# Altium schematic sheet CONNECTED-MODULE.SchDoc
size A; SheetNumber: 1; SheetTotal: 3
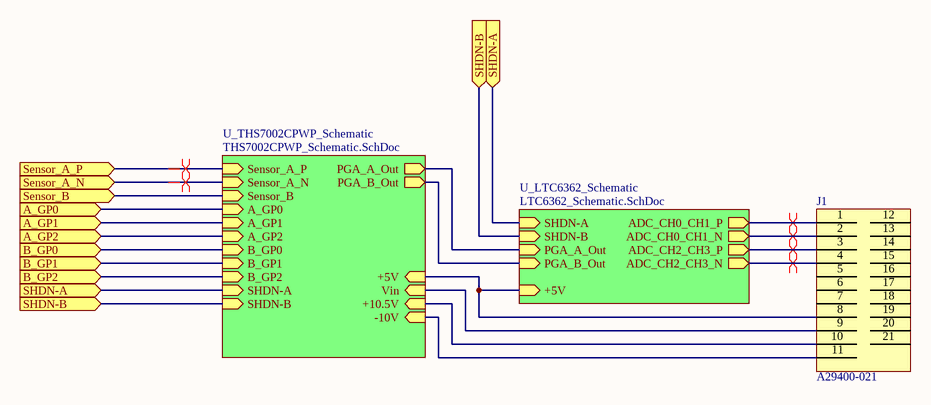
[diagram p0: CONNECTED-MODULE.SchDoc]

## Parts
J1  A29400-021

## Sub-sheets
U_LTC6362_Schematic = LTC6362_Schematic.SchDoc: SHDN-A (in), SHDN-B (in), ADC_CH2_CH3_P (out), ADC_CH2_CH3_N (out), ADC_CH0_CH1_P (out), ADC_CH0_CH1_N (out), PGA_A_Out (in), PGA_B_Out (in), +5V (in)
U_THS7002CPWP_Schematic = THS7002CPWP_Schematic.SchDoc: Sensor_A_P (in), Sensor_A_N (in), Sensor_B (in), A_GP0 (in), B_GP0 (in), A_GP1 (in), A_GP2 (in), B_GP1 (in), B_GP2 (in), SHDN-A (in), SHDN-B (in), PGA_A_Out (out), PGA_B_Out (out), +10.5V (in), -10V (in), +5V (in), Vin (in)

## Ports
A_GP0 (in), A_GP1 (in), A_GP2 (in), B_GP0 (in), B_GP1 (in), B_GP2 (in), Sensor_A_N (in), Sensor_A_P (in), Sensor_B (in), SHDN-A (in), SHDN-B (in)

## Nets
A_GP0: port A_GP0, sheet U_THS7002CPWP_Schematic/A_GP0
A_GP1: port A_GP1, sheet U_THS7002CPWP_Schematic/A_GP1
A_GP2: port A_GP2, sheet U_THS7002CPWP_Schematic/A_GP2
B_GP0: port B_GP0, sheet U_THS7002CPWP_Schematic/B_GP0
B_GP1: port B_GP1, sheet U_THS7002CPWP_Schematic/B_GP1
B_GP2: port B_GP2, sheet U_THS7002CPWP_Schematic/B_GP2
Sensor_A_N: port Sensor_A_N, sheet U_THS7002CPWP_Schematic/Sensor_A_N
Sensor_A_P: port Sensor_A_P, sheet U_THS7002CPWP_Schematic/Sensor_A_P
Sensor_B: port Sensor_B, sheet U_THS7002CPWP_Schematic/Sensor_B
SHDN-A: port SHDN-A, sheet U_LTC6362_Schematic/SHDN-A, sheet U_THS7002CPWP_Schematic/SHDN-A
SHDN-B: port SHDN-B, sheet U_LTC6362_Schematic/SHDN-B, sheet U_THS7002CPWP_Schematic/SHDN-B
NetJ1_1: J1.1 ; sheet U_LTC6362_Schematic/ADC_CH0_CH1_P
NetJ1_2: J1.2 ; sheet U_LTC6362_Schematic/ADC_CH0_CH1_N
NetJ1_3: J1.3 ; sheet U_LTC6362_Schematic/ADC_CH2_CH3_P
NetJ1_4: J1.4 ; sheet U_LTC6362_Schematic/ADC_CH2_CH3_N
NetJ1_8: J1.8 ; sheet U_LTC6362_Schematic/+5V, sheet U_THS7002CPWP_Schematic/+5V
NetJ1_9: J1.9 ; sheet U_THS7002CPWP_Schematic/Vin
NetJ1_10: J1.10 ; sheet U_THS7002CPWP_Schematic/+10.5V
NetJ1_11: J1.11 ; sheet U_THS7002CPWP_Schematic/-10V
(unnamed): sheet U_LTC6362_Schematic/PGA_A_Out, sheet U_THS7002CPWP_Schematic/PGA_A_Out
(unnamed): sheet U_LTC6362_Schematic/PGA_B_Out, sheet U_THS7002CPWP_Schematic/PGA_B_Out

Not connected (* = marked no-connect by the designer): J1 5 6 7 12 13 14 15 16 17 18 19 20 21

## Layout directives
differential pair: NetJ1_1, NetJ1_2, NetJ1_3, NetJ1_4, Sensor_A_N, Sensor_A_P

## Library data of the parts
J1 = A29400-021: 21 Position D-Type, Nano-D Receptacle, Female Sockets Connector